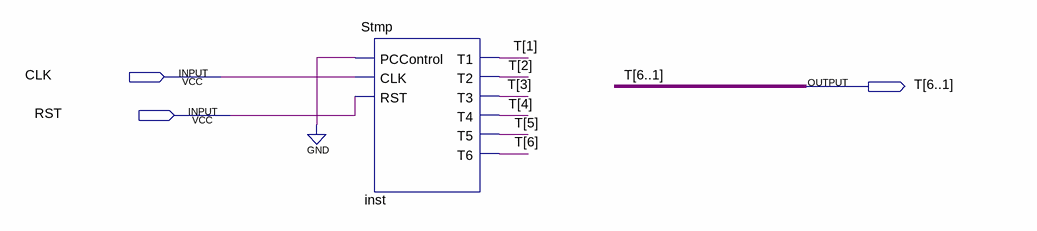
[diagram p0: schematic sheet]
// Quartus schematic stmp_test.bdf as structural Verilog: 1 symbols, 3 pins
module stmp_test (
  input  CLK,
  input  RST,
  output [6:1] T
);

  Stmp inst (.PCControl(1'b0), .CLK(CLK), .RST(RST), .T1(T[1]), .T2(T[2]), .T3(T[3]), .T4(T[4]), .T5(T[5]), .T6(T[6]));
endmodule
